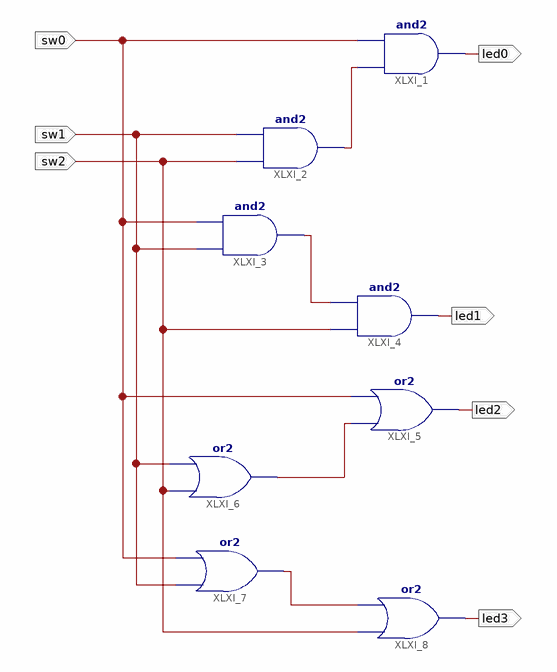
[diagram p0: schematic sheet 1]
// Xilinx ISE schematic sch.sch (spartan3e) as structural Verilog: 8 symbols, 7 ports
module sch (
  input  sw0,
  input  sw1,
  input  sw2,
  output led0,
  output led2,
  output led1,
  output led3
);

  wire XLXN_4, XLXN_10, XLXN_11, XLXN_12;

  and XLXI_1 (led0, XLXN_4, sw0);
  and XLXI_2 (XLXN_4, sw2, sw1);
  and XLXI_3 (XLXN_10, sw1, sw0);
  or XLXI_5 (led2, XLXN_11, sw0);
  or XLXI_6 (XLXN_11, sw2, sw1);
  and XLXI_4 (led1, sw2, XLXN_10);
  or XLXI_7 (XLXN_12, sw1, sw0);
  or XLXI_8 (led3, sw2, XLXN_12);
endmodule
